# Altium project TimeDrive.PrjPcb (part 1 of 3)
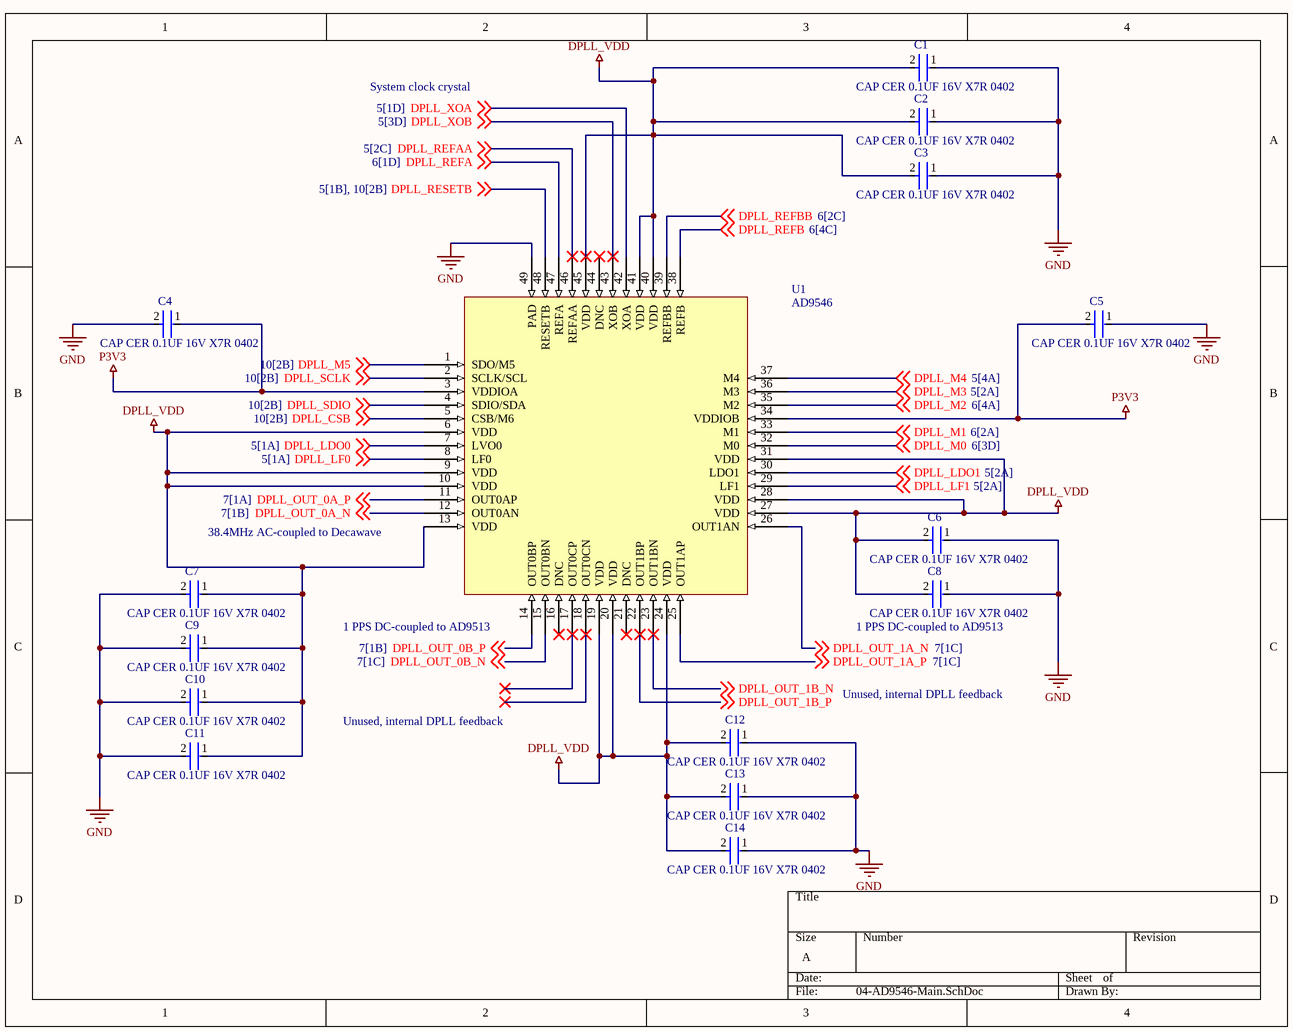
[diagram p0: 04-AD9546-Main.SchDoc]
13 sheets, 271 parts. Net scope: global (net labels, ports and power ports of the same name join across sheets).
Board file: TimeDrive.PcbDoc
Sheets:
  02-BlockDiagram.SchDoc
  04-AD9546-Main.SchDoc
  05-AD9546_StrapsXtal.SchDoc
  06-AD9546_TimestampInputs.SchDoc
  07-AD9546_Outputs.SchDoc
  08-AD9513-1.SchDoc
  09-AD9513-2.SchDoc
  10-Microcontroller-1.SchDoc
  11-UWB-Main.SchDoc
  13-UWB-Antenna.SchDoc
  14-I225-Main.SchDoc
  15-I225-MISC.SchDoc
  16-Power.SchDoc

## Sheet 02-BlockDiagram.SchDoc
size A; SheetNumber: 2; SheetTotal: 2

## Sheet 04-AD9546-Main.SchDoc
size A; SheetNumber: 4; SheetTotal: 16

### Parts
C1  GRM155R71C104KA88D  [FP-GRM15-MFG]  (value not drawn)
C2  GRM155R71C104KA88D  [FP-GRM15-MFG]  (value not drawn)
C3  GRM155R71C104KA88D  [FP-GRM15-MFG]  (value not drawn)
C4  GRM155R71C104KA88D  [FP-GRM15-MFG]  (value not drawn)
C5  GRM155R71C104KA88D  [FP-GRM15-MFG]  (value not drawn)
C6  GRM155R71C104KA88D  [FP-GRM15-MFG]  (value not drawn)
C7  GRM155R71C104KA88D  [FP-GRM15-MFG]  (value not drawn)
C8  GRM155R71C104KA88D  [FP-GRM15-MFG]  (value not drawn)
C9  GRM155R71C104KA88D  [FP-GRM15-MFG]  (value not drawn)
C10  GRM155R71C104KA88D  [FP-GRM15-MFG]  (value not drawn)
C11  GRM155R71C104KA88D  [FP-GRM15-MFG]  (value not drawn)
C12  GRM155R71C104KA88D  [FP-GRM15-MFG]  (value not drawn)
C13  GRM155R71C104KA88D  [FP-GRM15-MFG]  (value not drawn)
C14  GRM155R71C104KA88D  [FP-GRM15-MFG]  (value not drawn)
U1  AD9546  [AD9546]

### Nets
DPLL_VDD: C1.2 C2.2 C3.2 C6.2 C7.1 C8.2 C9.1 C10.1 C11.1 C12.2 C13.2 C14.2 U1.6(VDD) U1.9(VDD) U1.10(VDD) U1.13(VDD) U1.19(VDD) U1.20(VDD) U1.24(VDD) U1.27(VDD) U1.28(VDD) U1.31(VDD) U1.40(VDD) U1.41(VDD) U1.45(VDD)
GND: C1.1 C2.1 C3.1 C4.2 C5.1 C6.1 C7.2 C8.1 C9.2 C10.2 C11.2 C12.1 C13.1 C14.1 U1.49(PAD)
P3V3: C4.1 C5.2 U1.3(VDDIOA) U1.34(VDDIOB)
DPLL_CSB: U1.5(CSB/M6) ; off-sheet DPLL_CSB
DPLL_LDO0: U1.7(LVO0) ; off-sheet DPLL_LDO0
DPLL_LDO1: U1.30(LDO1) ; off-sheet DPLL_LDO1
DPLL_LF0: U1.8(LF0) ; off-sheet DPLL_LF0
DPLL_LF1: U1.29(LF1) ; off-sheet DPLL_LF1
DPLL_M0: U1.32(M0) ; off-sheet DPLL_M0
DPLL_M1: U1.33(M1) ; off-sheet DPLL_M1
DPLL_M2: U1.35(M2) ; off-sheet DPLL_M2
DPLL_M3: U1.36(M3) ; off-sheet DPLL_M3
DPLL_M4: U1.37(M4) ; off-sheet DPLL_M4
DPLL_M5: U1.1(SDO/M5) ; off-sheet DPLL_M5
DPLL_OUT_0A_N: U1.12(OUT0AN) ; off-sheet DPLL_OUT_0A_N
DPLL_OUT_0A_P: U1.11(OUT0AP) ; off-sheet DPLL_OUT_0A_P
DPLL_OUT_0B_N: U1.15(OUT0BN) ; off-sheet DPLL_OUT_0B_N
DPLL_OUT_0B_P: U1.14(OUT0BP) ; off-sheet DPLL_OUT_0B_P
DPLL_OUT_1A_N: U1.26(OUT1AN) ; off-sheet DPLL_OUT_1A_N
DPLL_OUT_1A_P: U1.25(OUT1AP) ; off-sheet DPLL_OUT_1A_P
DPLL_OUT_1B_N: U1.23(OUT1BN) ; off-sheet DPLL_OUT_1B_N
DPLL_OUT_1B_P: U1.22(OUT1BP) ; off-sheet DPLL_OUT_1B_P
DPLL_REFA: U1.47(REFA) ; off-sheet DPLL_REFA
DPLL_REFAA: U1.46(REFAA) ; off-sheet DPLL_REFAA
DPLL_REFB: U1.38(REFB) ; off-sheet DPLL_REFB
DPLL_REFBB: U1.39(REFBB) ; off-sheet DPLL_REFBB
DPLL_RESETB: U1.48(RESETB) ; off-sheet DPLL_RESETB
DPLL_SCLK: U1.2(SCLK/SCL) ; off-sheet DPLL_SCLK
DPLL_SDIO: U1.4(SDIO/SDA) ; off-sheet DPLL_SDIO
DPLL_XOA: U1.42(XOA) ; off-sheet DPLL_XOA
DPLL_XOB: U1.43(XOB) ; off-sheet DPLL_XOB

Not connected (* = marked no-connect by the designer): U1 16(DNC)* 17(OUT0CP)* 18(OUT0CN)* 21(DNC)* 44(DNC)*

### Notes on the sheet
- System clock crystal
- 38.4MHz AC-coupled to Decawave
- (near U1) 1 PPS DC-coupled to AD9513
- (near C8) 1 PPS DC-coupled to AD9513
- Unused, internal DPLL feedback

### Library data of the parts
C1-C14 = CMP-2100-03641-2: CAP CER 0.1UF 16V X7R 0402; Manufacturer: Murata; Standoff Height: 0mm; Tolerance: 10%; Voltage Rating: 16Vdc; Material: Ceramic; Capacitance: 0.10μF; Value: 0.10μF; RoHS: TRUE; Manufacturer Part Number: GRM155R71C104KA88D; Temperature Characteristic: X7R; Octopart: https://octopart.com/grm155r71c104ka88d-murata-196880; Digikey Description: CAP CER 0.1UF 16V X7R 0402; Device Class L3: Ceramic Capacitors; Height: 0.55mm; ComponentLink2Description: Datasheet; Temperature Range Low: -55°C; Ipc Land Pattern Name: CAPC10050X219; ComponentLink2URL: https://search.murata.co.jp/Ceramy/image/img/A01X/G101/ENG/GRM155R71H471KA01-01A.pdf; Device Class L1: Passive Components; Lead Free: yes; Category: Cap; Package: GRM15; Temperature: -55°C to +125°C; Device Class L2: Capacitors; Temperature Range High: +125°C; Mouser Description: 0402 0.1 uF 16V ±10 % Tolerance X7R SMT Multilayer Ceramic Capacitor

## Sheet 05-AD9546_StrapsXtal.SchDoc
size A; SheetNumber: 5; SheetTotal: 16
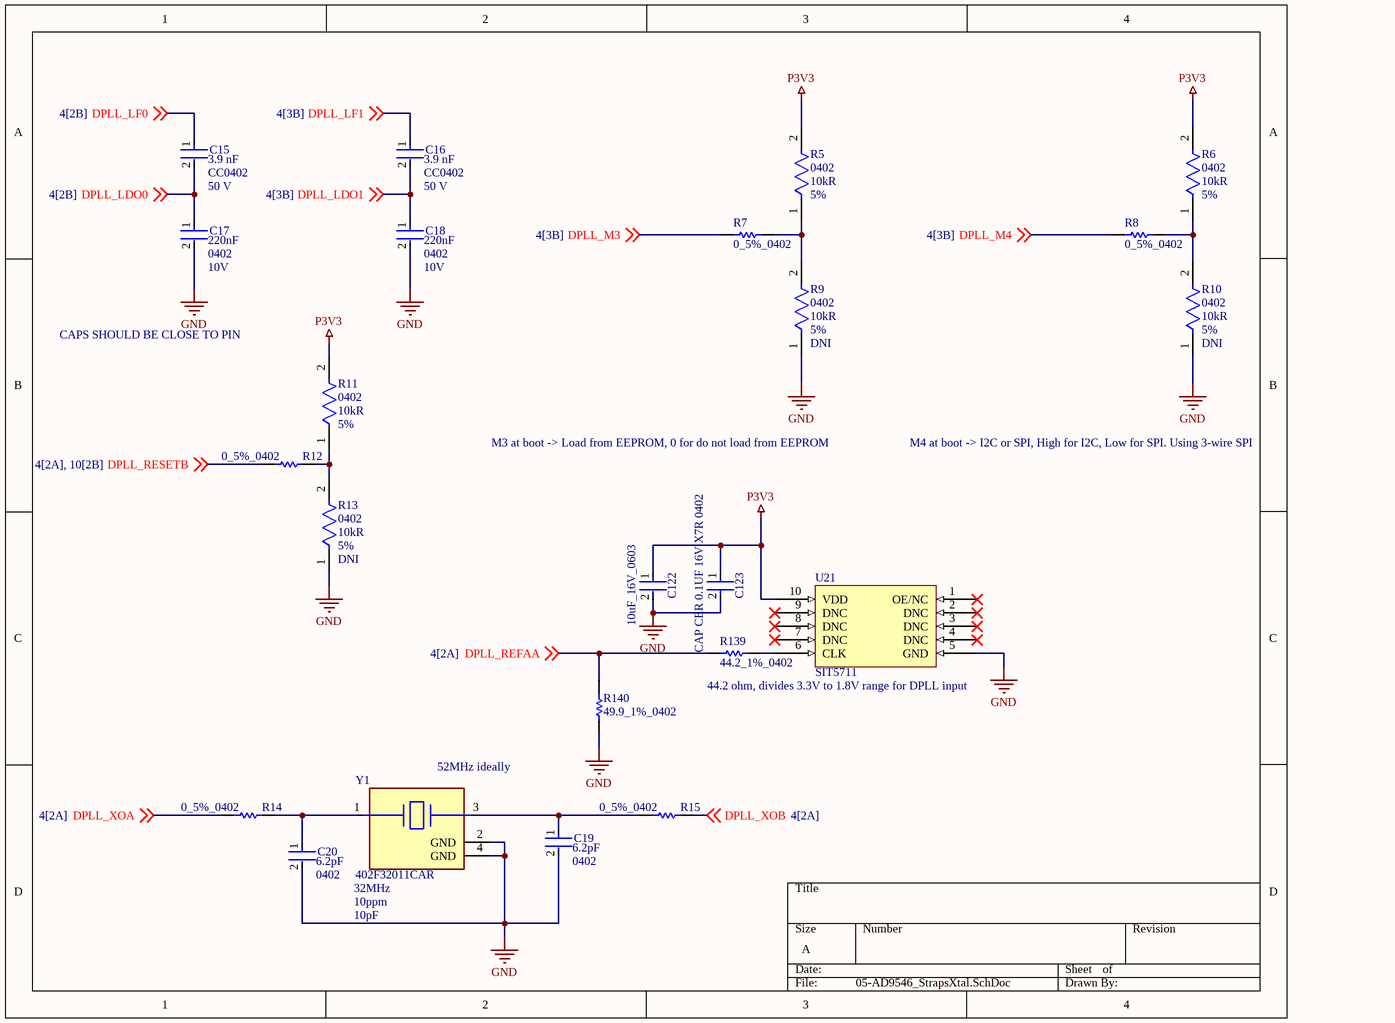
[diagram p1: 05-AD9546_StrapsXtal.SchDoc]

### Parts
C15  value 3.9 nF  Voltage Rating: 50 V  Package: CC0402  [FP-CC0402-MFG]  (hidden comment: CC0402KRX7R9BB392)
C16  value 3.9 nF  Voltage Rating: 50 V  Package: CC0402  [FP-CC0402-MFG]  (hidden comment: CC0402KRX7R9BB392)
C17  Voltage: 10V  Case/Package: 0402  Capacitance: 220nF  [FP-GRM155-0_05-IPC_A]  (hidden comment: GRM155R61A224KE19D)
C18  Voltage: 10V  Case/Package: 0402  Capacitance: 220nF  [FP-GRM155-0_05-IPC_A]  (hidden comment: GRM155R61A224KE19D)
C19  Case/Package: 0402  Capacitance: 6.2pF  [FP-CL468-IPC_C]  (hidden comment: CL05C6R2CB5NNNC)
C20  Case/Package: 0402  Capacitance: 6.2pF  [FP-CL468-IPC_C]  (hidden comment: CL05C6R2CB5NNNC)
C122  10uF_16V_0603  [FP-C1608-MFG]
C123  GRM155R71C104KA88D  [FP-GRM15-MFG]  (value not drawn)
R5  Case/Package: 0402  Resistance: 10kR  Tolerance: 5%  [FP-CRCW0402-e3-IPC_B]  (hidden comment: CRCW040210K0JNED)
R6  Case/Package: 0402  Resistance: 10kR  Tolerance: 5%  [FP-CRCW0402-e3-IPC_B]  (hidden comment: CRCW040210K0JNED)
R7  0_5%_0402  [RESC1005X40X25ML05T10]
R8  0_5%_0402  [RESC1005X40X25ML05T10]
R9  Case/Package: 0402  Resistance: 10kR  Tolerance: 5%  [FP-CRCW0402-e3-IPC_B]  (hidden comment: CRCW040210K0JNED)  (no BOM)
R10  Case/Package: 0402  Resistance: 10kR  Tolerance: 5%  [FP-CRCW0402-e3-IPC_B]  (hidden comment: CRCW040210K0JNED)  (no BOM)
R11  Case/Package: 0402  Resistance: 10kR  Tolerance: 5%  [FP-CRCW0402-e3-IPC_B]  (hidden comment: CRCW040210K0JNED)
R12  0_5%_0402  [RESC1005X40X25LL10T10]
R13  Case/Package: 0402  Resistance: 10kR  Tolerance: 5%  [FP-CRCW0402-e3-IPC_B]  (hidden comment: CRCW040210K0JNED)  (no BOM)
R14  0_5%_0402  [RESC1005X40X25LL10T10]
R15  0_5%_0402  [RESC1005X40X25LL10T10]
R139  44.2_1%_0402  [RESC0402(1005)_M]
R140  49.9_1%_0402  [RESC1005X40X25NL05T05]
U21  SIT5711  [SIT5711]
Y1  402F32011CAR  Frequency: 32MHz  Frequency Stability: 10ppm  Load Capacitance: 10pF  [FP-402-MFG]

### Nets
GND: C17.2 C18.2 C19.2 C20.2 C122.2 C123.2 R9.1 R10.1 R13.1 R140.1 U21.5(GND) Y1.2(GND) Y1.4(GND)
P3V3: C122.1 C123.1 R5.2 R6.2 R11.2 U21.10(VDD)
DPLL_LDO0: C15.2 C17.1 ; off-sheet DPLL_LDO0
DPLL_LDO1: C16.2 C18.1 ; off-sheet DPLL_LDO1
DPLL_LF0: C15.1 ; off-sheet DPLL_LF0
DPLL_LF1: C16.1 ; off-sheet DPLL_LF1
DPLL_M3: R7.1 ; off-sheet DPLL_M3
DPLL_M4: R8.1 ; off-sheet DPLL_M4
DPLL_REFAA: R139.1 R140.2 ; off-sheet DPLL_REFAA
DPLL_RESETB: R12.1 ; off-sheet DPLL_RESETB
DPLL_XOA: R14.1 ; off-sheet DPLL_XOA
DPLL_XOB: R15.2 ; off-sheet DPLL_XOB
NetC19_1: C19.1 R15.1 Y1.3
NetC20_1: C20.1 R14.2 Y1.1
NetR5_1: R5.1 R7.2 R9.2
NetR6_1: R6.1 R8.2 R10.2
NetR11_1: R11.1 R12.2 R13.2
NetR139_2: R139.2 U21.6(CLK)

Not connected (* = marked no-connect by the designer): U21 1(OE/NC)* 2(DNC)* 3(DNC)* 4(DNC)* 7(DNC)* 8(DNC)* 9(DNC)*

### Notes on the sheet
- CAPS SHOULD BE CLOSE TO PIN
- M3 at boot -> Load from EEPROM, 0 for do not load from EEPROM
- M4 at boot -> I2C or SPI, High for I2C, Low for SPI. Using 3-wire SPI
- 44.2 ohm, divides 3.3V to 1.8V range for DPLL input
- (near Y1) 52MHz ideally

### Library data of the parts
C15 C16 = CMP-03422-000890-1: CAP CER 3900PF 50V X7R 0402; Manufacturer: YAGEO; Tolerance: 0.1; Temperature Coefficient: 30ppm/°C; Material: Ceramic; Automotive Grade: NA; Digikey Description: CAP CER 3900PF 50V X7R 0402; Octopart: https://octopart.com/cc0402krx7r9bb392-yageo-9291741; Category: Cap; Temperature Characteristic: X7R; Footprint Url: http://www.yageo.com/exep/pages/download/literatures/UPY-C_GEN_24.pdf; Height: 0.55mm; ComponentLink2Description: Datasheet; Capacitance: 3.9 nF; RoHS: TRUE; Device Class L1: Passive Components; ComponentLink2URL: http://www.yageo.com/documents/recent/UPY-GP_NP0_16V-to-50V_16.pdf; Temperature Range Low: -55°C; Automotive: No; Manufacturer Part Number: CC0402KRX7R9BB392; Temperature: -55°C to +125°C; Ipc Land Pattern Name: CAPC10050X50; Device Class L3: Ceramic Capacitors; Device Class L2: Capacitors; Mouser Description: Multilayer Ceramic Capacitors MLCC - SMD/SMT 3.9nF 50V X7R 10%; Lead Free: Yes; Temperature Range High: +125°C
C17 C18 = CMP-2008-04561-5: CAP CER 0.22UF 10V X5R 0402; Tolerance: 10%; Material: Ceramic; Insulation Resistance: 10GR; Package Quantity: 1; Termination: SMD/SMT; Max Operating Temperature: 85°C; REACH SVHC: No SVHC; Thickness: 0.022inch; Mount: Surface Mount; Height: 0.5mm; Length: 1mm; Lead Free: Lead Free; Number of Pins: 2; Case Code (Imperial): 0402; Min Operating Temperature: -55°C; Packaging: Tape and Reel; Dielectric: X5R; Depth: 0.5mm; Series: GRM; Case Code (Metric): 1005; Radiation Hardening: No; RoHS Compliant: Yes; Voltage Rating (DC): 10V; Voltage Rating: 10V; Dielectric Material: Ceramic; Width: 0.5mm
C19 C20 = CMP-13271-000420-1: Cap Ceramic 6.2pF 50V C0G ±0.25pF SMD 0402 +125°C Paper T/R; Radiation Hardening: No; Voltage Rating (DC): 50V; Thickness: 0.022inch; Height: 0.5mm; Case Code (Metric): 1005; Max Operating Temperature: 125°C; Case Code (Imperial): 0402; Voltage Rating: 50V; Min Operating Temperature: -55°C; Width: 0.02inch; Depth: 0.5mm; Length: 1mm; Dielectric: C0G; Packaging: Tape and Reel; Mount: Surface Mount
C122 = CMP-08246-000019-1: CAP CER 10UF 16V X5R 0603; Manufacturer: TDK Corporation; Manufacturer Part Number: C1608X5R1C106M080AB; Temperature Coefficient: 15%; Tolerance: 20%; Material: Ceramic; Octopart: https://octopart.com/c1608x5r1c106m080ab-tdk-26013480; ComponentLink2Description: Datasheet; Value: 10uF; Temperature Range Low: -55°C; Digikey Description: CAP CER 10UF 16V X5R 0603; Package: C1608; Lead Free: Yes; Mouser Description: Multilayer Ceramic Capacitors MLCC - SMD/SMT 0603 10uF 16volts X5R +/-20% GP; Device Class L2: Capacitors; Voltage Rating: 16V; RoHS: TRUE; Automotive: No; Height: 0.9mm; Ipc Land Pattern Name: CAPC16080X80; ComponentLink2URL: https://upverter.com/datasheet/6fbac97fd59b4a24a005814037d2a36a27db40e9.pdf; Temperature Range High: +85°C; Capacitance: 10uF; Temperature: -55°C to +85°C; Category: Cap; Device Class L1: Passive Components; Device Class L3: Ceramic Capacitors; Temperature Characteristic: X5R
C123 = CMP-2100-03641-2: as C1 on sheet 04-AD9546-Main; RoHS: TRUE; Manufacturer Part Number: GRM155R71C104KA88D; Temperature Characteristic: X7R; Octopart: https://octopart.com/grm155r71c104ka88d-murata-196880; Digikey Description: CAP CER 0.1UF 16V X7R 0402; Device Class L3: Ceramic Capacitors; Height: 0.55mm; ComponentLink2Description: Datasheet; Temperature Range Low: -55°C; Ipc Land Pattern Name: CAPC10050X219; ComponentLink2URL: https://search.murata.co.jp/Ceramy/image/img/A01X/G101/ENG/GRM155R71H471KA01-01A.pdf; Device Class L1: Passive Components; Lead Free: yes; Category: Cap; Package: GRM15; Temperature: -55°C to +125°C; Device Class L2: Capacitors; Temperature Range High: +125°C; Mouser Description: 0402 0.1 uF 16V ±10 % Tolerance X7R SMT Multilayer Ceramic Capacitor
R5 R6 R9-R11 R13 = CMP-2002-08136-3: RES Thick Film, 10kΩ, 5%, 0.063W, 200ppm/°C, 0402; Voltage Rating: 50V; Power Rating: 63mW; Military Standard: Not; Packaging: Tape and Reel; Case Code (Imperial): 0402; Min Operating Temperature: -55°C; Case Code (Metric): 1005; Temperature Coefficient: 200ppm/°C; Termination: SMD/SMT; Composition: Thick Film; Depth: 0.5mm; Number of Terminations: 2; Contact Plating: Tin; Height: 0.016inch; Width: 0.5mm; Max Operating Temperature: 155°C; Features: Automotive AEC-Q200; Length: 1mm; Radiation Hardening: No; Max Power Dissipation: 63mW; Mount: Surface Mount; Package Quantity: 1; Weight: 2.3E-05oz
  R9 R10 R13: DNI: DNI
R7 R8 = CMP-2002-03041-1: Part Number: CRCW04020000Z0EDHP; Manufacturer: Vishay Dale
R12 R14 R15 = CMP-2002-04569-1: Manufacturer: KOA Speer; Part Number: RK73Z1ETTP
R139 = CMP-1011-00357-1: 44R2 0.063W 1% 0402 (1005 Metric)  SMD; Case-Metric: 1005; Value: 44.20 Ohm; Case-EIA: 0402; Tolerance: 1 %; Technology: SMT; Power: 0.063 W
R140 = CMP-2002-00969-1: Manufacturer: Panasonic; Part Number: ERJ-2RKF49R9X
Y1 = CMP-06858-000005-1: CRYSTAL 32.0000MHZ 10PF SMD; Series Resistance: 100R; Width: 0.063inch; Height: 0.022inch; Frequency Tolerance: 10ppm; Length: 0.079inch; Contact Plating: Gold; Package Quantity: 3000; Case/Package: SMD/SMT; ESR (Equivalent Series Resistance): 100R; Min Operating Temperature: -20°C; Tolerance: 10ppm; Packaging: Tape and Reel; Max Operating Temperature: 70°C; Mount: Surface Mount; Termination: SMD/SMT

## Sheet 06-AD9546_TimestampInputs.SchDoc
size A; SheetNumber: 6; SheetTotal: 16
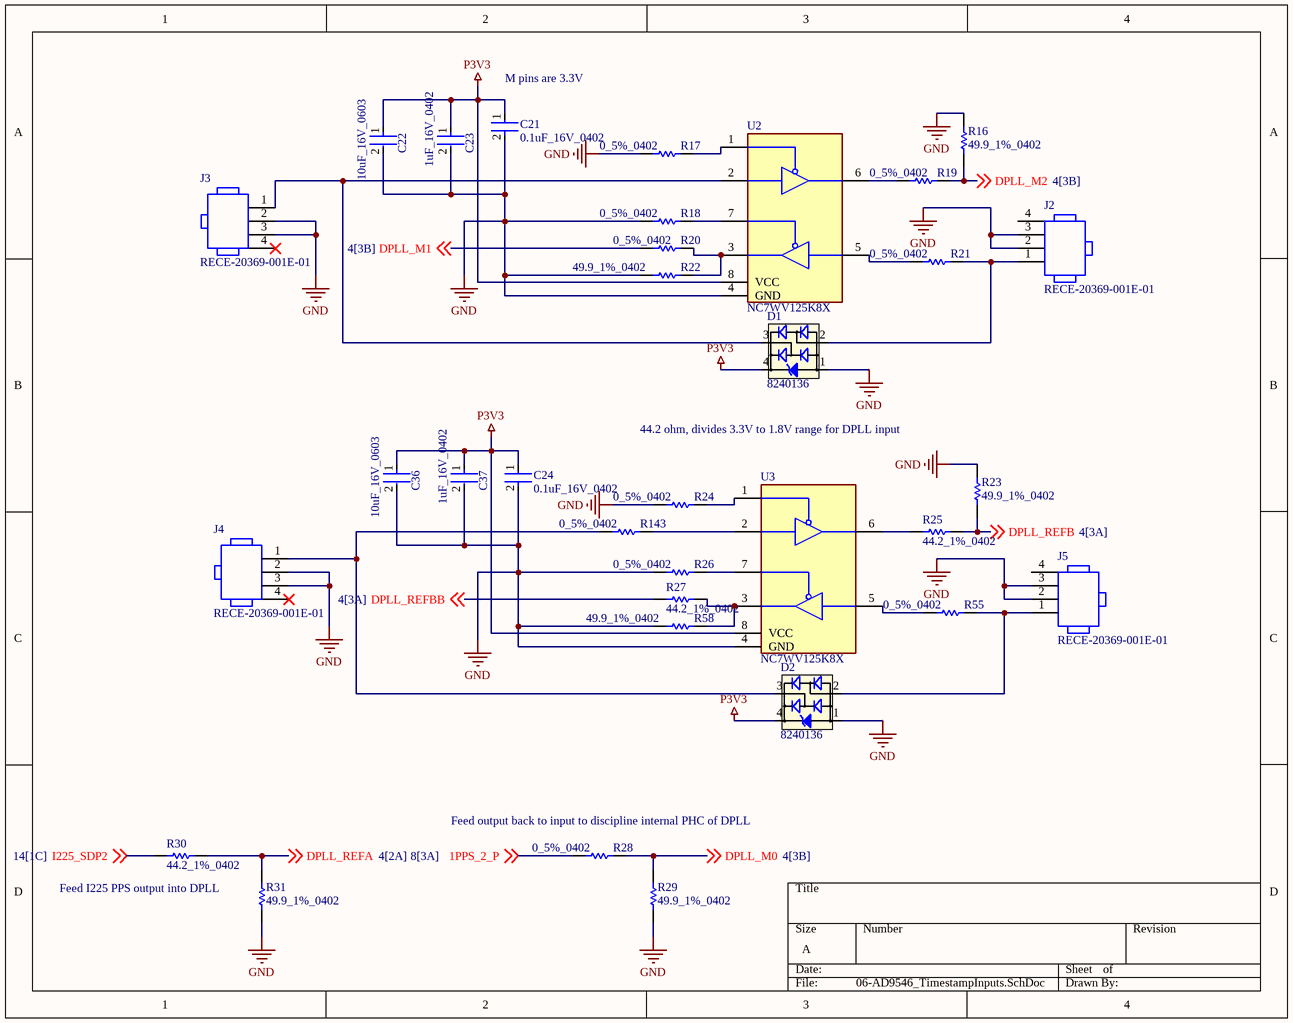
[diagram p2: 06-AD9546_TimestampInputs.SchDoc]

### Parts
C21  Digikey Description: 0.1uF_16V_0402  [FP-GRM15-MFG]  (hidden comment: GRM155R71C104KA88D)
C22  10uF_16V_0603  [FP-C1608-MFG]
C23  1uF_16V_0402  [FP-0402-L_1_0_0_05-W_0_5-IPC_C]
C24  Digikey Description: 0.1uF_16V_0402  [FP-GRM15-MFG]  (hidden comment: GRM155R71C104KA88D)
C36  10uF_16V_0603  [FP-C1608-MFG]
C37  1uF_16V_0402  [FP-0402-L_1_0_0_05-W_0_5-IPC_C]
D1  8240136  [SOT143-4L]
D2  8240136  [SOT143-4L]
J2  RECE-20369-001E-01  [TG-RECE-20369-001E-4_V]
J3  RECE-20369-001E-01  [TG-RECE-20369-001E-4_V]
J4  RECE-20369-001E-01  [TG-RECE-20369-001E-4_V]
J5  RECE-20369-001E-01  [TG-RECE-20369-001E-4_V]
R16  49.9_1%_0402  [RESC1005X40X25NL05T05]
R17  0_5%_0402  [RESC1005X40X25LL10T10]
R18  0_5%_0402  [RESC1005X40X25LL10T10]
R19  0_5%_0402  [RESC1005X40X25LL10T10]
R20  0_5%_0402  [RESC1005X40X25LL10T10]
R21  0_5%_0402  [RESC1005X40X25LL10T10]
R22  49.9_1%_0402  [RESC1005X40X25NL05T05]
R23  49.9_1%_0402  [RESC1005X40X25NL05T05]
R24  0_5%_0402  [RESC1005X40X25LL10T10]
R25  44.2_1%_0402  [RESC1005X40X25LL05T05]
R26  0_5%_0402  [RESC1005X40X25LL10T10]
R27  44.2_1%_0402  [RESC1005X40X25LL05T05]
R28  0_5%_0402  [RESC1005X40X25LL10T10]
R29  49.9_1%_0402  [RESC1005X40X25NL05T05]
R30  44.2_1%_0402  [RESC1005X40X25LL05T05]
R31  49.9_1%_0402  [RESC1005X40X25NL05T05]
R55  0_5%_0402  [RESC1005X40X25LL10T10]
R58  49.9_1%_0402  [RESC1005X40X25NL05T05]
R143  0_5%_0402  [RESC1005X40X25LL10T10]
U2  NC7WV125K8X  [NC7WV125]
U3  NC7WV125K8X  [NC7WV125]

### Nets
GND: C21.2 C22.2 C23.2 C24.2 C36.2 C37.2 D1.1(GND) D2.1(GND) J2.2 J2.3 J3.2 J3.3 J4.2 J4.3 J5.2 J5.3 R16.2 R17.1 R18.1 R22.2 R23.2 R24.1 R26.1 R29.1 R31.1 R58.2 U2.4(GND) U3.4(GND)
P3V3: C21.1 C22.1 C23.1 C24.1 C36.1 C37.1 D1.4(VDD) D2.4(VDD) U2.8(VCC) U3.8(VCC)
1PPS_2_P: R28.1 ; off-sheet 1PPS_2_P
DPLL_M0: R28.2 R29.2 ; off-sheet DPLL_M0
DPLL_M1: R20.1 ; off-sheet DPLL_M1
DPLL_M2: R16.1 R19.2 ; off-sheet DPLL_M2
DPLL_REFA: R30.2 R31.2 ; off-sheet DPLL_REFA
DPLL_REFB: R23.1 R25.2 ; off-sheet DPLL_REFB
DPLL_REFBB: R27.1 ; off-sheet DPLL_REFBB
I225_SDP2: R30.1 ; off-sheet I225_SDP2
NetD1_2: D1.2(I/O1) J2.1 R21.2
NetD1_3: D1.3(I/O2) J3.1 U2.2
NetD2_2: D2.2(I/O1) J5.1 R55.2
NetD2_3: D2.3(I/O2) J4.1 R143.1
NetR17_2: R17.2 U2.1
NetR18_2: R18.2 U2.7
NetR19_1: R19.1 U2.6
NetR20_2: R20.2 R22.1 U2.3
NetR21_1: R21.1 U2.5
NetR24_2: R24.2 U3.1
NetR25_1: R25.1 U3.6
NetR26_2: R26.2 U3.7
NetR27_2: R27.2 R58.1 U3.3
NetR55_1: R55.1 U3.5
NetR143_2: R143.2 U3.2

Not connected (* = marked no-connect by the designer): J2 4; J3 4*; J4 4*; J5 4

### Notes on the sheet
- (near C21) M pins are 3.3V
- 44.2 ohm, divides 3.3V to 1.8V range for DPLL input
- (near R28) Feed output back to input to discipline internal PHC of DPLL
- Feed I225 PPS output into DPLL

### Library data of the parts
C21 C24 = CMP-2100-03641-2: as C1 on sheet 04-AD9546-Main; RoHS: TRUE; Manufacturer Part Number: GRM155R71C104KA88D; Temperature Characteristic: X7R; Octopart: https://octopart.com/grm155r71c104ka88d-murata-196880; Device Class L3: Ceramic Capacitors; Height: 0.55mm; ComponentLink2Description: Datasheet; Temperature Range Low: -55°C; Ipc Land Pattern Name: CAPC10050X219; ComponentLink2URL: https://search.murata.co.jp/Ceramy/image/img/A01X/G101/ENG/GRM155R71H471KA01-01A.pdf; Device Class L1: Passive Components; Lead Free: yes; Category: Cap; Package: GRM15; Temperature: -55°C to +125°C; Device Class L2: Capacitors; Temperature Range High: +125°C; Mouser Description: 0402 0.1 uF 16V ±10 % Tolerance X7R SMT Multilayer Ceramic Capacitor
C22 C36 = CMP-08246-000019-1: as C122 on sheet 05-AD9546_StrapsXtal; Octopart: https://octopart.com/c1608x5r1c106m080ab-tdk-26013480; ComponentLink2Description: Datasheet; Value: 10uF; Temperature Range Low: -55°C; Digikey Description: CAP CER 10UF 16V X5R 0603; Package: C1608; Lead Free: Yes; Mouser Description: Multilayer Ceramic Capacitors MLCC - SMD/SMT 0603 10uF 16volts X5R +/-20% GP; Device Class L2: Capacitors; Voltage Rating: 16V; RoHS: TRUE; Automotive: No; Height: 0.9mm; Ipc Land Pattern Name: CAPC16080X80; ComponentLink2URL: https://upverter.com/datasheet/6fbac97fd59b4a24a005814037d2a36a27db40e9.pdf; Temperature Range High: +85°C; Capacitance: 10uF; Temperature: -55°C to +85°C; Category: Cap; Device Class L1: Passive Components; Device Class L3: Ceramic Capacitors; Temperature Characteristic: X5R
C23 C37 = CMP-14477-003537-2: None; Tolerance: 20%; Voltage Rating (DC): 16V; Capacitance: 1uF; Dielectric: X5R; Height: 0.5mm; Package Quantity: 10000; Series: M; Max Operating Temperature: 85°C; Width: 0.02inch; Mount: Surface Mount; Thickness: 0.022inch; Length: 1mm; Min Operating Temperature: -55°C; Depth: 0.5mm; RoHS Compliant: Yes; Construction: Flat; Case/Package: 0402; Radiation Hardening: No; Packaging: Tape and Reel; Voltage: 16V; Voltage Rating: 16V; Halogen Free: Halogen Free
D1 D2 = CMP-1486-00002-1: TVS Diode WE-TVS-HS, VRWM=3.3V; Manufacturer: Wuerth Elektronik; Reverse Stand Off Voltage: 3.3V; PartNumber: 8240136; ComponentLink1Description: Manufacturer URL; PackageReference: SOT143-4L; ComponentLink1URL: http://www.we-online.com; ComponentLink2Description: Datasheet; ComponentLink2URL: http://katalog.we-online.de/kataloge/eisos/media/pdf/8240136.pdf
J2-J5 = CMP-0275-00001-2: RF Connector, Onboard Receptacle, IPEX MHFIII; Manufacturer: Taoglas; Packing: Tape and Reel; Mounting Technology: Surface Mount; PackageReference: RECE-20369-001E-01-4; ComponentLink1URL: http://www.taoglas.com/; Housing Color: Gold; DatasheetVersion: Rev. C; ComponentLink2URL: http://www.taoglas.com/images/product_images/original_images/RECE.20369.001E.01.pdf; ComponentLink3Description: Package Specification; PackageVersion: Rev. C; ComponentLink1Description: Manufacturer URL; ComponentLink2Description: Datasheet; PackageDescription: 4-Pin, Hand Drawn, Body 1.7x1.7mm; ComponentLink3URL: http://www.taoglas.com/images/product_images/original_images/RECE.20369.001E.01.pdf; PartNumber: RECE-20369-001E-01
R16 R22 R23 R29 R31 R58 = CMP-2002-00969-1: as R140 on sheet 05-AD9546_StrapsXtal
R17-R21 R24 R26 R28 R55 R143 = CMP-2002-04569-1: as R12 on sheet 05-AD9546_StrapsXtal
R25 R27 R30 = CMP-2002-00011-1: Manufacturer: Vishay Dale; Part Number: CRCW040244R2FKED
U2 U3 = NC7WV125K8X: Integrated Circuit; Manufacturer_Name: ON Semiconductor; Datasheet Link: https://www.mouser.com/datasheet/2/308/NC7WV125-1301459.pdf; Height: 0.9mm; Manufacturer_Part_Number: NC7WV125K8X; Mouser Part Number: 512-NC7WV125K8X; Mouser Price/Stock: https://www.mouser.com/Search/Refine.aspx?Keyword=512-NC7WV125K8X; Arrow Part Number: NC7WV125K8X; Arrow Price/Stock: https://www.arrow.com/en/products/nc7wv125k8x/on-semiconductor

## Sheet 07-AD9546_Outputs.SchDoc
size A; SheetNumber: 7; SheetTotal: 16
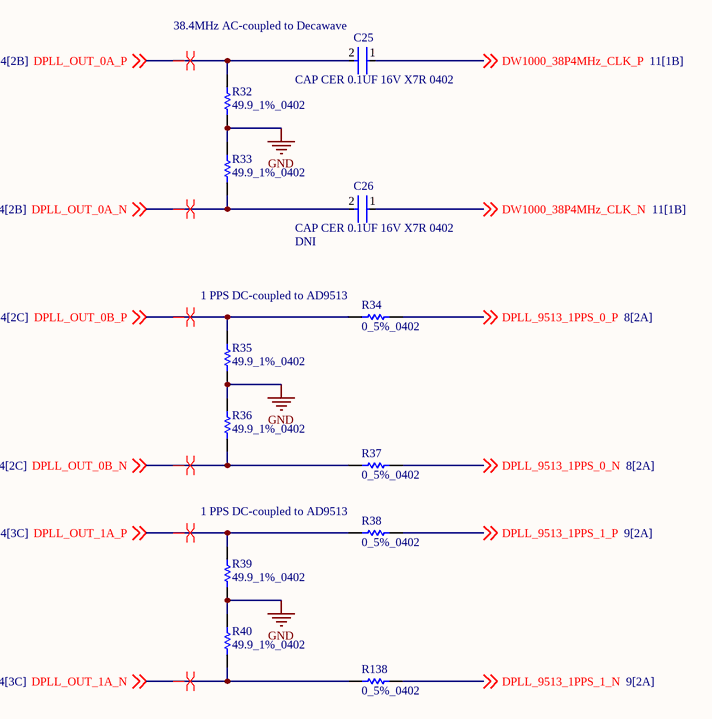
[diagram p3: 07-AD9546_Outputs.SchDoc]

### Parts
C25  GRM155R71C104KA88D  [FP-GRM15-MFG]  (value not drawn)
C26  GRM155R71C104KA88D  [FP-GRM15-MFG]  (value not drawn)
R32  49.9_1%_0402  [RESC1005X40X25NL05T05]
R33  49.9_1%_0402  [RESC1005X40X25NL05T05]
R34  0_5%_0402  [RESC1005X40X25LL10T10]
R35  49.9_1%_0402  [RESC1005X40X25NL05T05]
R36  49.9_1%_0402  [RESC1005X40X25NL05T05]
R37  0_5%_0402  [RESC1005X40X25LL10T10]
R38  0_5%_0402  [RESC1005X40X25LL10T10]
R39  49.9_1%_0402  [RESC1005X40X25NL05T05]
R40  49.9_1%_0402  [RESC1005X40X25NL05T05]
R138  0_5%_0402  [RESC1005X40X25LL10T10]

### Nets
GND: R32.1 R33.2 R35.1 R36.2 R39.1 R40.2
DPLL_9513_1PPS_0_N: R37.2 ; off-sheet DPLL_9513_1PPS_0_N
DPLL_9513_1PPS_0_P: R34.2 ; off-sheet DPLL_9513_1PPS_0_P
DPLL_9513_1PPS_1_N: R138.2 ; off-sheet DPLL_9513_1PPS_1_N
DPLL_9513_1PPS_1_P: R38.2 ; off-sheet DPLL_9513_1PPS_1_P
DPLL_OUT_0A_N: C26.2 R33.1 ; off-sheet DPLL_OUT_0A_N
DPLL_OUT_0A_P: C25.2 R32.2 ; off-sheet DPLL_OUT_0A_P
DPLL_OUT_0B_N: R36.1 R37.1 ; off-sheet DPLL_OUT_0B_N
DPLL_OUT_0B_P: R34.1 R35.2 ; off-sheet DPLL_OUT_0B_P
DPLL_OUT_1A_N: R40.1 R138.1 ; off-sheet DPLL_OUT_1A_N
DPLL_OUT_1A_P: R38.1 R39.2 ; off-sheet DPLL_OUT_1A_P
DW1000_38P4MHz_CLK_N: C26.1 ; off-sheet DW1000_38P4MHz_CLK_N
DW1000_38P4MHz_CLK_P: C25.1 ; off-sheet DW1000_38P4MHz_CLK_P

### Layout directives
differential pair: DPLL_OUT_0A_N, DPLL_OUT_0A_P, DPLL_OUT_0B_N, DPLL_OUT_0B_P, DPLL_OUT_1A_N, DPLL_OUT_1A_P

### Notes on the sheet
- (near C25) 38.4MHz AC-coupled to Decawave
- (near R34) 1 PPS DC-coupled to AD9513
- (near R38) 1 PPS DC-coupled to AD9513

### Library data of the parts
C25 C26 = CMP-2100-03641-2: as C1 on sheet 04-AD9546-Main; RoHS: TRUE; Manufacturer Part Number: GRM155R71C104KA88D; Temperature Characteristic: X7R; Octopart: https://octopart.com/grm155r71c104ka88d-murata-196880; Digikey Description: CAP CER 0.1UF 16V X7R 0402; Device Class L3: Ceramic Capacitors; Height: 0.55mm; ComponentLink2Description: Datasheet; Temperature Range Low: -55°C; Ipc Land Pattern Name: CAPC10050X219; ComponentLink2URL: https://search.murata.co.jp/Ceramy/image/img/A01X/G101/ENG/GRM155R71H471KA01-01A.pdf; Device Class L1: Passive Components; Lead Free: yes; Category: Cap; Package: GRM15; Temperature: -55°C to +125°C; Device Class L2: Capacitors; Temperature Range High: +125°C; Mouser Description: 0402 0.1 uF 16V ±10 % Tolerance X7R SMT Multilayer Ceramic Capacitor
  C26: DNI: DNI
R32 R33 R35 R36 R39 R40 = CMP-2002-00969-1: as R140 on sheet 05-AD9546_StrapsXtal
R34 R37 R38 R138 = CMP-2002-04569-1: as R12 on sheet 05-AD9546_StrapsXtal

## Sheet 08-AD9513-1.SchDoc
size A; SheetNumber: 8; SheetTotal: 16
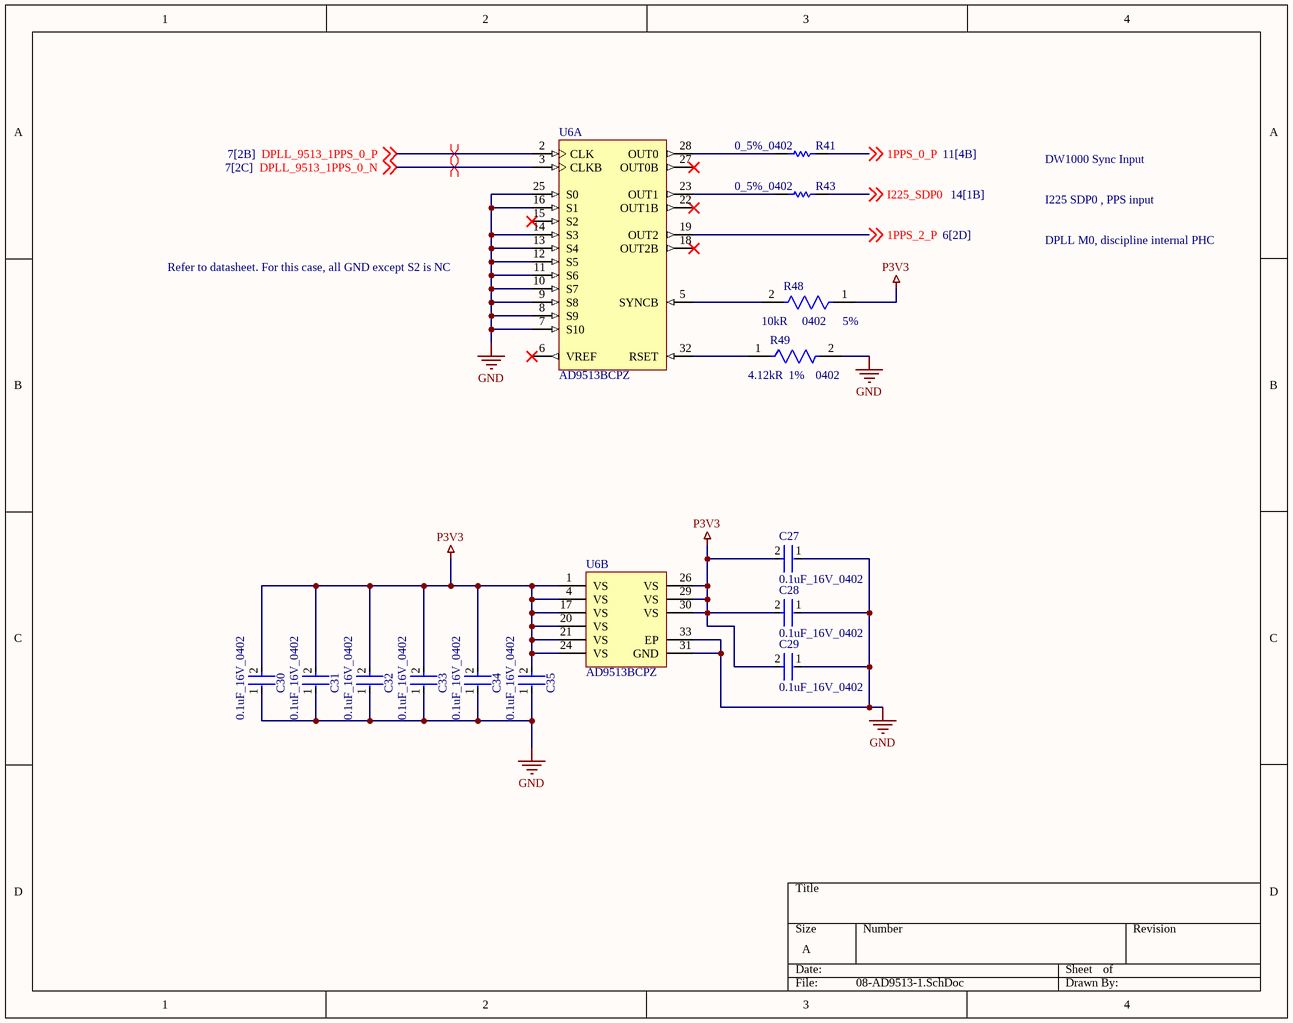
[diagram p4: 08-AD9513-1.SchDoc]

### Parts
C27  0.1uF_16V_0402  [FP-GRM15-MFG]
C28  0.1uF_16V_0402  [FP-GRM15-MFG]
C29  0.1uF_16V_0402  [FP-GRM15-MFG]
C30  0.1uF_16V_0402  [FP-GRM15-MFG]
C31  0.1uF_16V_0402  [FP-GRM15-MFG]
C32  0.1uF_16V_0402  [FP-GRM15-MFG]
C33  0.1uF_16V_0402  [FP-GRM15-MFG]
C34  0.1uF_16V_0402  [FP-GRM15-MFG]
C35  0.1uF_16V_0402  [FP-GRM15-MFG]
R41  0_5%_0402  [RESC1005X40X25LL10T10]
R43  0_5%_0402  [RESC1005X40X25LL10T10]
R48  Case/Package: 0402  Resistance: 10kR  Tolerance: 5%  [FP-CRCW0402-e3-IPC_B]  (hidden comment: CRCW040210K0JNED)
R49  Resistance: 4.12kR  Case/Package: 0402  Tolerance: 1%  [FP-CRCW0402-e3-IPC_A]  (hidden comment: CRCW04024K12FKED)
U6  AD9513BCPZ  [ADI-CP-32-2_N]  (parts A,B of 2)

### Nets
GND: C27.1 C28.1 C29.1 C30.1 C31.1 C32.1 C33.1 C34.1 C35.1 R49.2 U6.7(S10) U6.8(S9) U6.9(S8) U6.10(S7) U6.11(S6) U6.12(S5) U6.13(S4) U6.14(S3) U6.16(S1) U6.25(S0) U6.31(GND) U6.33(EP)
P3V3: C27.2 C28.2 C29.2 C30.2 C31.2 C32.2 C33.2 C34.2 C35.2 R48.1 U6.1(VS) U6.4(VS) U6.17(VS) U6.20(VS) U6.21(VS) U6.24(VS) U6.26(VS) U6.29(VS) U6.30(VS)
1PPS_0_P: R41.2 ; off-sheet 1PPS_0_P
1PPS_2_P: U6.19(OUT2) ; off-sheet 1PPS_2_P
DPLL_9513_1PPS_0_N: U6.3(CLKB) ; off-sheet DPLL_9513_1PPS_0_N
DPLL_9513_1PPS_0_P: U6.2(CLK) ; off-sheet DPLL_9513_1PPS_0_P
I225_SDP0: R43.2 ; off-sheet I225_SDP0
NetR41_1: R41.1 U6.28(OUT0)
NetR43_1: R43.1 U6.23(OUT1)
NetR48_2: R48.2 U6.5(SYNCB)
NetR49_1: R49.1 U6.32(RSET)

Not connected (* = marked no-connect by the designer): U6 6(VREF)* 15(S2)* 18(OUT2B)* 22(OUT1B)* 27(OUT0B)*

### Layout directives
differential pair: DPLL_9513_1PPS_0_N, DPLL_9513_1PPS_0_P

### Notes on the sheet
- DW1000 Sync Input
- I225 SDP0 , PPS input
- (near U6) Refer to datasheet. For this case, all GND except S2 is NC
- DPLL M0, discipline internal PHC

### Library data of the parts
C27-C35 = CMP-2100-03641-2: CAP CER 0.1UF 16V X7R 0402; Manufacturer Part Number: GRM155R71C104KA88D; Manufacturer: Murata; Standoff Height: 0mm; Tolerance: 10%; Voltage Rating: 16Vdc; Material: Ceramic; Capacitance: 0.10μF; Value: 0.10μF; RoHS: TRUE; Temperature Characteristic: X7R; Octopart: https://octopart.com/grm155r71c104ka88d-murata-196880; Digikey Description: CAP CER 0.1UF 16V X7R 0402; Device Class L3: Ceramic Capacitors; Height: 0.55mm; ComponentLink2Description: Datasheet; Temperature Range Low: -55°C; Ipc Land Pattern Name: CAPC10050X219; ComponentLink2URL: https://search.murata.co.jp/Ceramy/image/img/A01X/G101/ENG/GRM155R71H471KA01-01A.pdf; Device Class L1: Passive Components; Lead Free: yes; Category: Cap; Package: GRM15; Temperature: -55°C to +125°C; Device Class L2: Capacitors; Temperature Range High: +125°C; Mouser Description: 0402 0.1 uF 16V ±10 % Tolerance X7R SMT Multilayer Ceramic Capacitor
R41 R43 = CMP-2002-04569-1: as R12 on sheet 05-AD9546_StrapsXtal
R48 = CMP-2002-08136-3: as R5 on sheet 05-AD9546_StrapsXtal; Military Standard: Not; Packaging: Tape and Reel; Case Code (Imperial): 0402; Min Operating Temperature: -55°C; Case Code (Metric): 1005; Temperature Coefficient: 200ppm/°C; Termination: SMD/SMT; Composition: Thick Film; Depth: 0.5mm; Number of Terminations: 2; Contact Plating: Tin; Height: 0.016inch; Width: 0.5mm; Max Operating Temperature: 155°C; Features: Automotive AEC-Q200; Length: 1mm; Radiation Hardening: No; Max Power Dissipation: 63mW; Mount: Surface Mount; Package Quantity: 1; Weight: 2.3E-05oz
R49 = CMP-1011-00579-3: RES Thick Film, 4.12kΩ, 1%, 0.063W, 100ppm/°C, 0402; Power Rating: 63mW; Voltage Rating: 50V; Temperature Coefficient: 100ppm/°C; Max Operating Temperature: 155°C; Number of Terminations: 2; Number of Pins: 2; Radiation Hardening: No; Features: Automotive AEC-Q200; Height: 0.35mm; Length: 1mm; Lead Free: Lead Free; Military Standard: Not; Composition: Thick Film; Weight: 2.3E-05oz; Case Code (Metric): 1005; Case Code (Imperial): 0402; Max Power Dissipation: 63mW; Contact Plating: Tin; Min Operating Temperature: -55°C; Width: 0.02inch; Packaging: Tape and Reel; Depth: 0.5mm; Termination: SMD/SMT; Voltage Rating (DC): 50V; Package Quantity: 10
U6 = CMP-0288-00055-2: 3 Outputs, 800 MHz Clock Distribution IC with Dividers and Delay Adjust, 3.3 V Supply, Industrial, 32-pin QFN (CP-32-2), Tray; Manufacturer: Analog Devices; # of Outputs: 3; Max f-out: 800 MHz; On-Chip VCO or DCO: No; I/O Interface: Pin Select; Supply Voltage (V): 3.3; Output Logic: CMOS, LVDS; # of Inputs: 1; Packing: Tray; DatasheetVersion: Rev. 0; ComponentLink5Description: Reference Circuit; PartNumber: AD9513BCPZ; ComponentLink1Description: Manufacturer URL; ComponentLink2Description: Datasheet; ComponentLink1URL: http://www.analog.com/en/index.html; ComponentLink4URL: http://www.analog.com/en/clock-and-timing/clock-generation-and-distribution/ad9513/products/product.html; Code_JEDEC: MO-220-VHHD-2; ComponentLink3URL: http://www.analog.com/static/imported-files/packages/414143737956480539664569CP_32_2.pdf; PackageDescription: 32-Pin Lead Frame Chip Scale Package, Body 5 x 5 mm, Pitch 0.5 mm; PackageReference: CP-32-2; ComponentLink3Description: Package Specification; ComponentLink4Description: Product URL; Mounting Technology: Surface Mount; PackageVersion: 01/2005; ComponentLink2URL: http://www.analog.com/static/imported-files/data_sheets/AD9513.pdf; ComponentLink5URL: http://www.analog.com/en/clock-and-timing/clock-generation-and-distribution/ad9513/products/product.html#product-recommendations

## Sheet 09-AD9513-2.SchDoc
size A; SheetNumber: 9; SheetTotal: 16
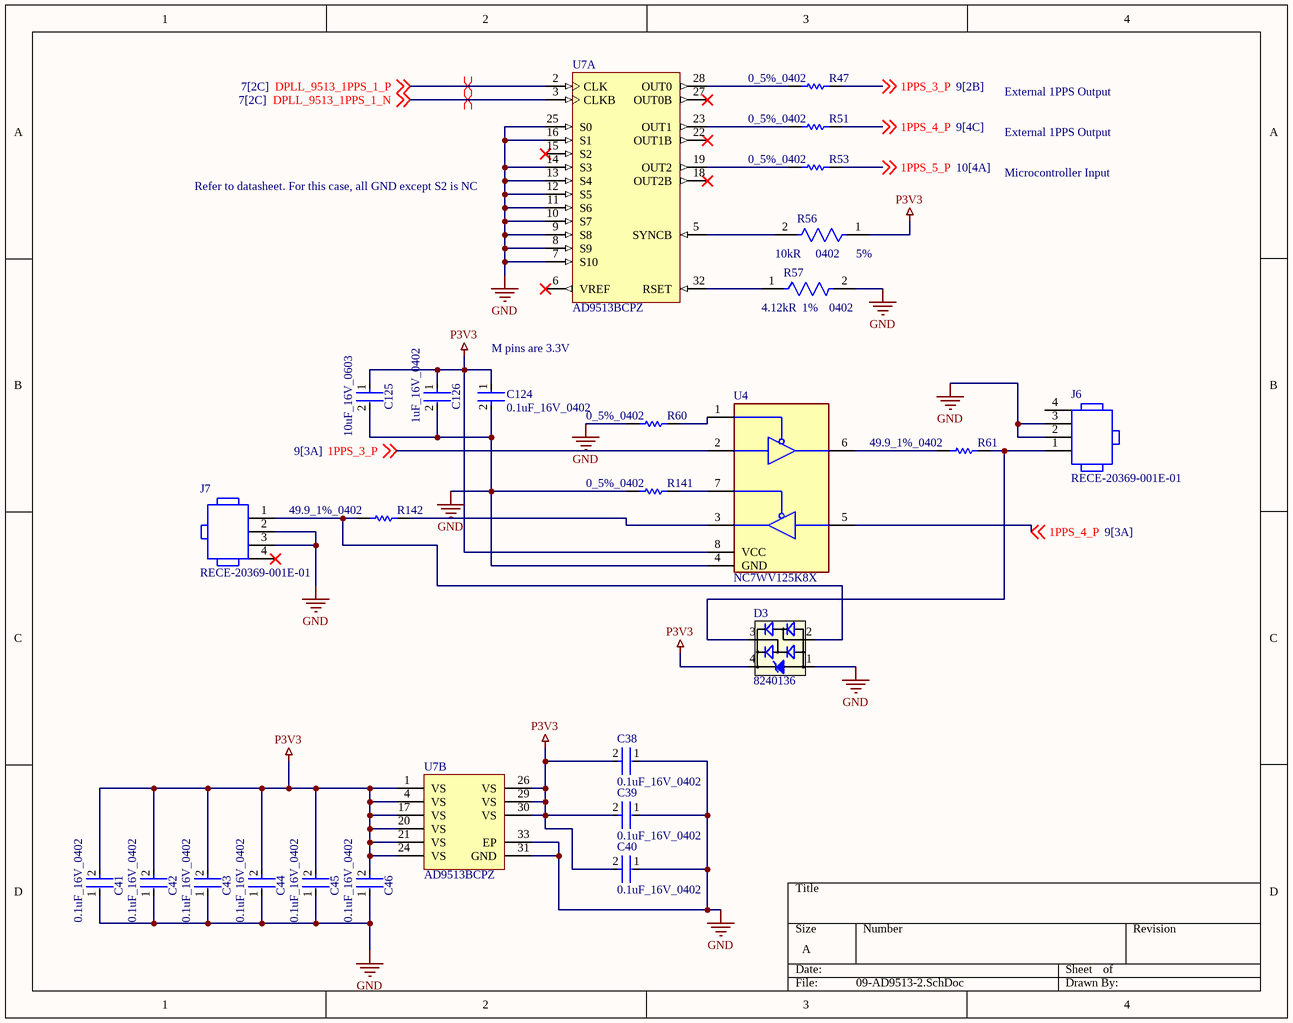
[diagram p5: 09-AD9513-2.SchDoc]

### Parts
C38  0.1uF_16V_0402  [FP-GRM15-MFG]
C39  0.1uF_16V_0402  [FP-GRM15-MFG]
C40  0.1uF_16V_0402  [FP-GRM15-MFG]
C41  0.1uF_16V_0402  [FP-GRM15-MFG]
C42  0.1uF_16V_0402  [FP-GRM15-MFG]
C43  0.1uF_16V_0402  [FP-GRM15-MFG]
C44  0.1uF_16V_0402  [FP-GRM15-MFG]
C45  0.1uF_16V_0402  [FP-GRM15-MFG]
C46  0.1uF_16V_0402  [FP-GRM15-MFG]
C124  Digikey Description: 0.1uF_16V_0402  [FP-GRM15-MFG]  (hidden comment: GRM155R71C104KA88D)
C125  10uF_16V_0603  [FP-C1608-MFG]
C126  1uF_16V_0402  [FP-0402-L_1_0_0_05-W_0_5-IPC_C]
D3  8240136  [SOT143-4L]
J6  RECE-20369-001E-01  [TG-RECE-20369-001E-4_V]
J7  RECE-20369-001E-01  [TG-RECE-20369-001E-4_V]
R47  0_5%_0402  [RESC1005X40X25LL10T10]
R51  0_5%_0402  [RESC1005X40X25LL10T10]
R53  0_5%_0402  [RESC1005X40X25LL10T10]
R56  Case/Package: 0402  Resistance: 10kR  Tolerance: 5%  [FP-CRCW0402-e3-IPC_B]  (hidden comment: CRCW040210K0JNED)
R57  Resistance: 4.12kR  Case/Package: 0402  Tolerance: 1%  [FP-CRCW0402-e3-IPC_A]  (hidden comment: CRCW04024K12FKED)
R60  0_5%_0402  [RESC1005X40X25LL10T10]
R61  49.9_1%_0402  [RESC1005X40X25NL05T05]
R141  0_5%_0402  [RESC1005X40X25LL10T10]
R142  49.9_1%_0402  [RESC1005X40X25NL05T05]
U4  NC7WV125K8X  [NC7WV125]
U7  AD9513BCPZ  [ADI-CP-32-2_N]  (parts A,B of 2)

### Nets
GND: C38.1 C39.1 C40.1 C41.1 C42.1 C43.1 C44.1 C45.1 C46.1 C124.2 C125.2 C126.2 D3.1(GND) J6.2 J6.3 J7.2 J7.3 R57.2 R60.1 R141.1 U4.4(GND) U7.7(S10) U7.8(S9) U7.9(S8) U7.10(S7) U7.11(S6) U7.12(S5) U7.13(S4) U7.14(S3) U7.16(S1) U7.25(S0) U7.31(GND) U7.33(EP)
P3V3: C38.2 C39.2 C40.2 C41.2 C42.2 C43.2 C44.2 C45.2 C46.2 C124.1 C125.1 C126.1 D3.4(VDD) R56.1 U4.8(VCC) U7.1(VS) U7.4(VS) U7.17(VS) U7.20(VS) U7.21(VS) U7.24(VS) U7.26(VS) U7.29(VS) U7.30(VS)
1PPS_3_P: R47.2 U4.2 ; off-sheet 1PPS_3_P
1PPS_4_P: R51.2 U4.5 ; off-sheet 1PPS_4_P
1PPS_5_P: R53.2 ; off-sheet 1PPS_5_P
DPLL_9513_1PPS_1_N: U7.3(CLKB) ; off-sheet DPLL_9513_1PPS_1_N
DPLL_9513_1PPS_1_P: U7.2(CLK) ; off-sheet DPLL_9513_1PPS_1_P
NetD3_2: D3.2(I/O1) J7.1 R142.2
NetD3_3: D3.3(I/O2) J6.1 R61.1
NetR47_1: R47.1 U7.28(OUT0)
NetR51_1: R51.1 U7.23(OUT1)
NetR53_1: R53.1 U7.19(OUT2)
NetR56_2: R56.2 U7.5(SYNCB)
NetR57_1: R57.1 U7.32(RSET)
NetR60_2: R60.2 U4.1
NetR61_2: R61.2 U4.6
NetR141_2: R141.2 U4.7
NetR142_1: R142.1 U4.3

Not connected (* = marked no-connect by the designer): J6 4; J7 4*; U7 6(VREF)* 15(S2)* 18(OUT2B)* 22(OUT1B)* 27(OUT0B)*

### Layout directives
differential pair: DPLL_9513_1PPS_1_N, DPLL_9513_1PPS_1_P

### Notes on the sheet
- External 1PPS Output
- (near U7) Refer to datasheet. For this case, all GND except S2 is NC
- Microcontroller Input
- M pins are 3.3V

### Library data of the parts
C38-C46 = CMP-2100-03641-2: as C27 on sheet 08-AD9513-1; RoHS: TRUE; Temperature Characteristic: X7R; Octopart: https://octopart.com/grm155r71c104ka88d-murata-196880; Digikey Description: CAP CER 0.1UF 16V X7R 0402; Device Class L3: Ceramic Capacitors; Height: 0.55mm; ComponentLink2Description: Datasheet; Temperature Range Low: -55°C; Ipc Land Pattern Name: CAPC10050X219; ComponentLink2URL: https://search.murata.co.jp/Ceramy/image/img/A01X/G101/ENG/GRM155R71H471KA01-01A.pdf; Device Class L1: Passive Components; Lead Free: yes; Category: Cap; Package: GRM15; Temperature: -55°C to +125°C; Device Class L2: Capacitors; Temperature Range High: +125°C; Mouser Description: 0402 0.1 uF 16V ±10 % Tolerance X7R SMT Multilayer Ceramic Capacitor
C124 = CMP-2100-03641-2: as C1 on sheet 04-AD9546-Main; RoHS: TRUE; Manufacturer Part Number: GRM155R71C104KA88D; Temperature Characteristic: X7R; Octopart: https://octopart.com/grm155r71c104ka88d-murata-196880; Device Class L3: Ceramic Capacitors; Height: 0.55mm; ComponentLink2Description: Datasheet; Temperature Range Low: -55°C; Ipc Land Pattern Name: CAPC10050X219; ComponentLink2URL: https://search.murata.co.jp/Ceramy/image/img/A01X/G101/ENG/GRM155R71H471KA01-01A.pdf; Device Class L1: Passive Components; Lead Free: yes; Category: Cap; Package: GRM15; Temperature: -55°C to +125°C; Device Class L2: Capacitors; Temperature Range High: +125°C; Mouser Description: 0402 0.1 uF 16V ±10 % Tolerance X7R SMT Multilayer Ceramic Capacitor
C125 = CMP-08246-000019-1: as C122 on sheet 05-AD9546_StrapsXtal; Octopart: https://octopart.com/c1608x5r1c106m080ab-tdk-26013480; ComponentLink2Description: Datasheet; Value: 10uF; Temperature Range Low: -55°C; Digikey Description: CAP CER 10UF 16V X5R 0603; Package: C1608; Lead Free: Yes; Mouser Description: Multilayer Ceramic Capacitors MLCC - SMD/SMT 0603 10uF 16volts X5R +/-20% GP; Device Class L2: Capacitors; Voltage Rating: 16V; RoHS: TRUE; Automotive: No; Height: 0.9mm; Ipc Land Pattern Name: CAPC16080X80; ComponentLink2URL: https://upverter.com/datasheet/6fbac97fd59b4a24a005814037d2a36a27db40e9.pdf; Temperature Range High: +85°C; Capacitance: 10uF; Temperature: -55°C to +85°C; Category: Cap; Device Class L1: Passive Components; Device Class L3: Ceramic Capacitors; Temperature Characteristic: X5R
C126 = CMP-14477-003537-2: as C23 on sheet 06-AD9546_TimestampInputs; Height: 0.5mm; Package Quantity: 10000; Series: M; Max Operating Temperature: 85°C; Width: 0.02inch; Mount: Surface Mount; Thickness: 0.022inch; Length: 1mm; Min Operating Temperature: -55°C; Depth: 0.5mm; RoHS Compliant: Yes; Construction: Flat; Case/Package: 0402; Radiation Hardening: No; Packaging: Tape and Reel; Voltage: 16V; Voltage Rating: 16V; Halogen Free: Halogen Free
D3 = CMP-1486-00002-1: as D1 on sheet 06-AD9546_TimestampInputs; PartNumber: 8240136; ComponentLink1Description: Manufacturer URL; PackageReference: SOT143-4L; ComponentLink1URL: http://www.we-online.com; ComponentLink2Description: Datasheet; ComponentLink2URL: http://katalog.we-online.de/kataloge/eisos/media/pdf/8240136.pdf
J6 J7 = CMP-0275-00001-2: as J2 on sheet 06-AD9546_TimestampInputs; Mounting Technology: Surface Mount; PackageReference: RECE-20369-001E-01-4; ComponentLink1URL: http://www.taoglas.com/; Housing Color: Gold; DatasheetVersion: Rev. C; ComponentLink2URL: http://www.taoglas.com/images/product_images/original_images/RECE.20369.001E.01.pdf; ComponentLink3Description: Package Specification; PackageVersion: Rev. C; ComponentLink1Description: Manufacturer URL; ComponentLink2Description: Datasheet; PackageDescription: 4-Pin, Hand Drawn, Body 1.7x1.7mm; ComponentLink3URL: http://www.taoglas.com/images/product_images/original_images/RECE.20369.001E.01.pdf; PartNumber: RECE-20369-001E-01
R47 R51 R53 R60 R141 = CMP-2002-04569-1: as R12 on sheet 05-AD9546_StrapsXtal
R56 = CMP-2002-08136-3: as R5 on sheet 05-AD9546_StrapsXtal; Military Standard: Not; Packaging: Tape and Reel; Case Code (Imperial): 0402; Min Operating Temperature: -55°C; Case Code (Metric): 1005; Temperature Coefficient: 200ppm/°C; Termination: SMD/SMT; Composition: Thick Film; Depth: 0.5mm; Number of Terminations: 2; Contact Plating: Tin; Height: 0.016inch; Width: 0.5mm; Max Operating Temperature: 155°C; Features: Automotive AEC-Q200; Length: 1mm; Radiation Hardening: No; Max Power Dissipation: 63mW; Mount: Surface Mount; Package Quantity: 1; Weight: 2.3E-05oz
R57 = CMP-1011-00579-3: as R49 on sheet 08-AD9513-1; Temperature Coefficient: 100ppm/°C; Max Operating Temperature: 155°C; Number of Terminations: 2; Number of Pins: 2; Radiation Hardening: No; Features: Automotive AEC-Q200; Height: 0.35mm; Length: 1mm; Lead Free: Lead Free; Military Standard: Not; Composition: Thick Film; Weight: 2.3E-05oz; Case Code (Metric): 1005; Case Code (Imperial): 0402; Max Power Dissipation: 63mW; Contact Plating: Tin; Min Operating Temperature: -55°C; Width: 0.02inch; Packaging: Tape and Reel; Depth: 0.5mm; Termination: SMD/SMT; Voltage Rating (DC): 50V; Package Quantity: 10
R61 R142 = CMP-2002-00969-1: as R140 on sheet 05-AD9546_StrapsXtal
U4 = NC7WV125K8X: as U2 on sheet 06-AD9546_TimestampInputs; Datasheet Link: https://www.mouser.com/datasheet/2/308/NC7WV125-1301459.pdf; Height: 0.9mm; Manufacturer_Part_Number: NC7WV125K8X; Mouser Part Number: 512-NC7WV125K8X; Mouser Price/Stock: https://www.mouser.com/Search/Refine.aspx?Keyword=512-NC7WV125K8X; Arrow Part Number: NC7WV125K8X; Arrow Price/Stock: https://www.arrow.com/en/products/nc7wv125k8x/on-semiconductor
U7 = CMP-0288-00055-2: as U6 on sheet 08-AD9513-1; Packing: Tray; DatasheetVersion: Rev. 0; ComponentLink5Description: Reference Circuit; PartNumber: AD9513BCPZ; ComponentLink1Description: Manufacturer URL; ComponentLink2Description: Datasheet; ComponentLink1URL: http://www.analog.com/en/index.html; ComponentLink4URL: http://www.analog.com/en/clock-and-timing/clock-generation-and-distribution/ad9513/products/product.html; Code_JEDEC: MO-220-VHHD-2; ComponentLink3URL: http://www.analog.com/static/imported-files/packages/414143737956480539664569CP_32_2.pdf; PackageDescription: 32-Pin Lead Frame Chip Scale Package, Body 5 x 5 mm, Pitch 0.5 mm; PackageReference: CP-32-2; ComponentLink3Description: Package Specification; ComponentLink4Description: Product URL; Mounting Technology: Surface Mount; PackageVersion: 01/2005; ComponentLink2URL: http://www.analog.com/static/imported-files/data_sheets/AD9513.pdf; ComponentLink5URL: http://www.analog.com/en/clock-and-timing/clock-generation-and-distribution/ad9513/products/product.html#product-recommendations